# EAGLE schematic jtag-adapter-1-1 (EAGLE 8.4.3)
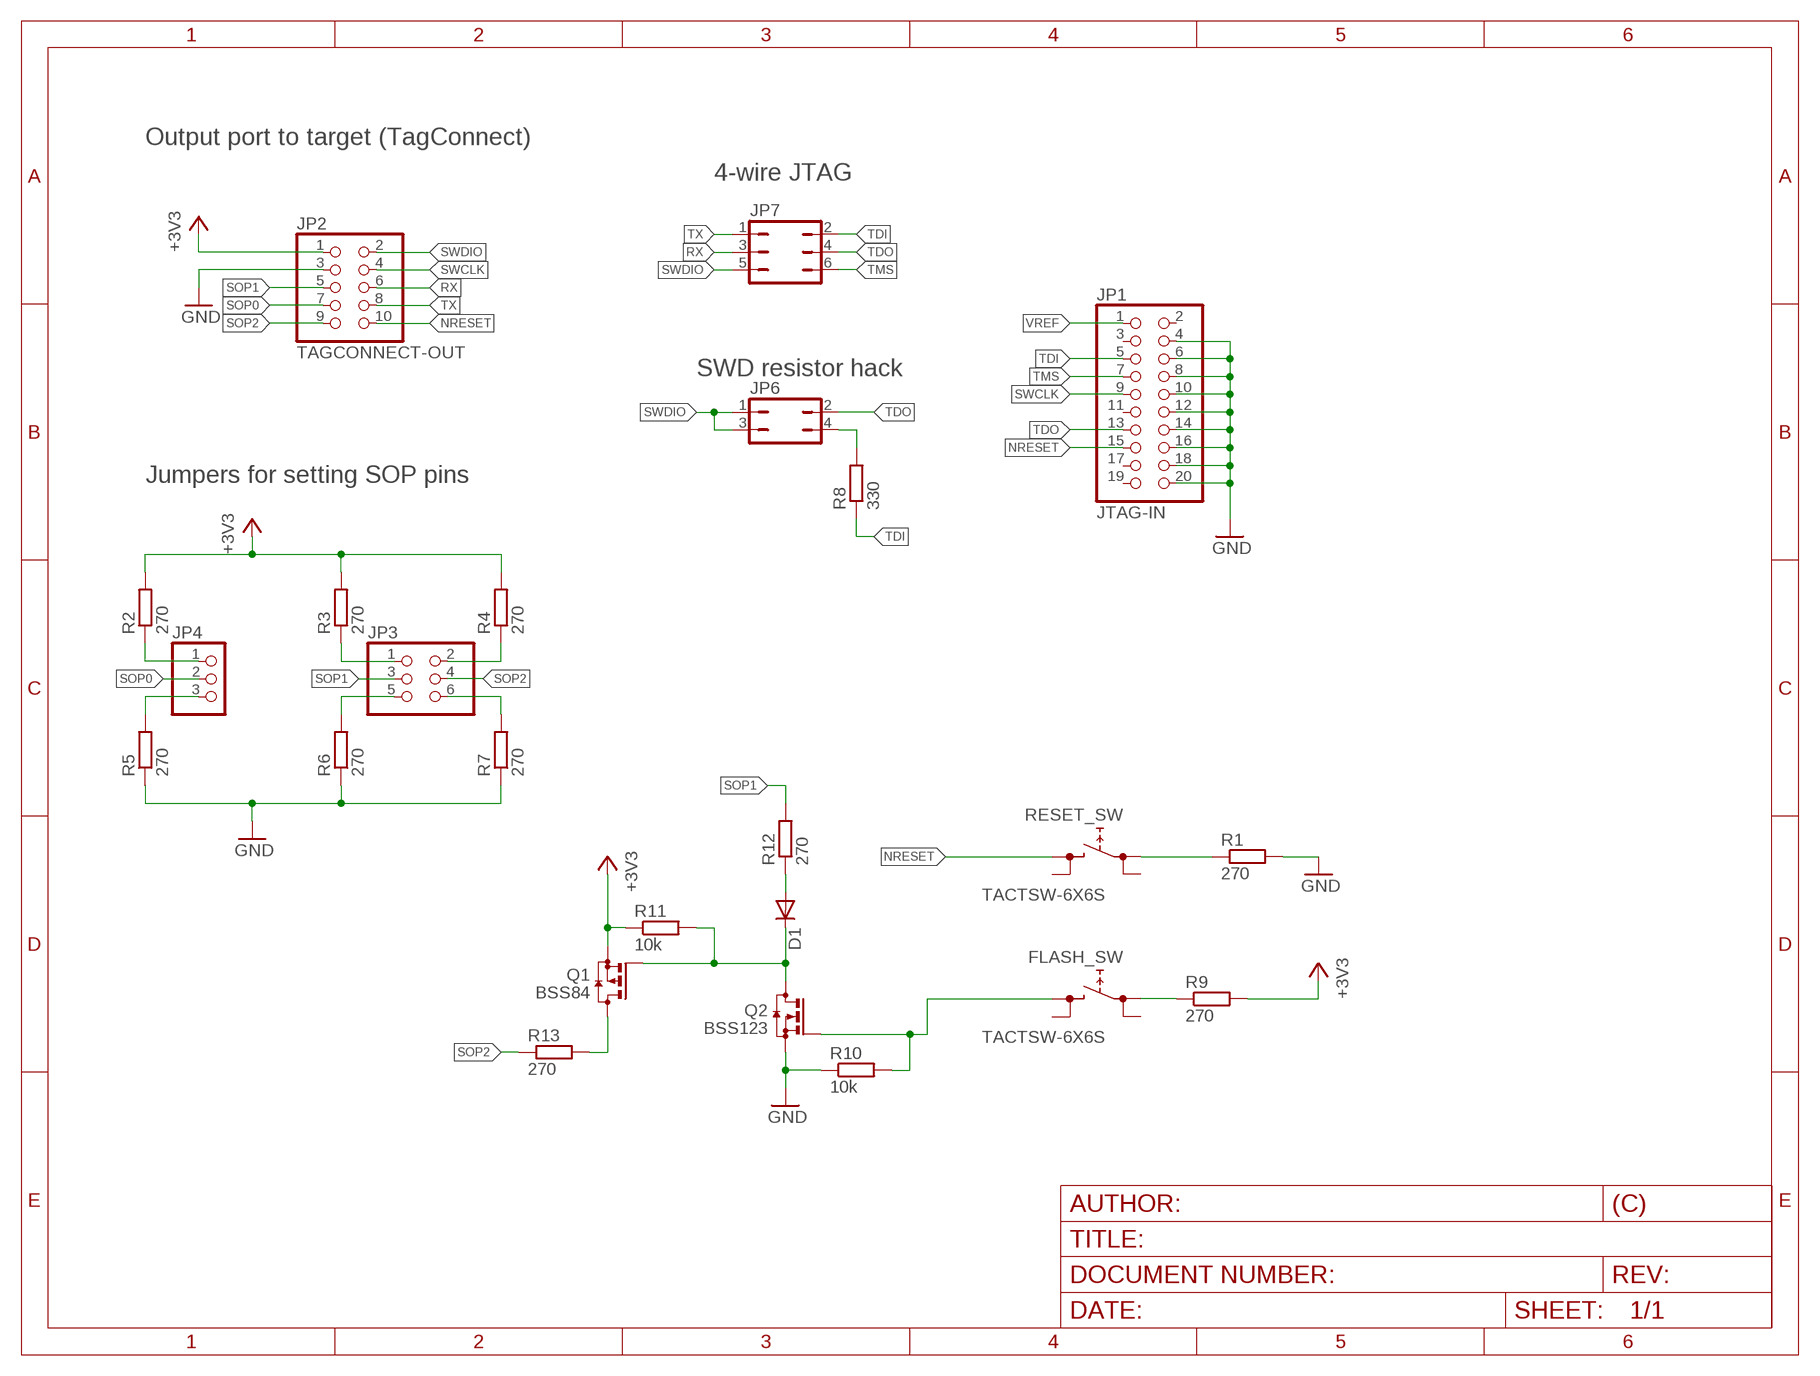
[diagram p0: schematic, sheet 1]

## Parts
D1  DIODE-MINIMELF  [MINIMELF]
FLASH_SW  TACTSW-6X6S  [TACTSW-6X6]
JP1  JTAG-IN  PINHD-2X10/90  [2X10/90]
JP2  TAGCONNECT-OUT  PINHD-2X5CN  [CON10M]
JP3  PINHD-2X3  [2X03]
JP4  PINHD-1X3  [1X03]
JP6  JP2Q  [JP2Q]
JP7  JP3Q  [JP3Q]
Q1  BSS84  [SOT23]
Q2  BSS123  [SOT23]
R1  270  R-EU_R0805  [R0805]
R2  270  R-EU_R0805  [R0805]
R3  270  R-EU_R0805  [R0805]
R4  270  R-EU_R0805  [R0805]
R5  270  R-EU_R0805  [R0805]
R6  270  R-EU_R0805  [R0805]
R7  270  R-EU_R0805  [R0805]
R8  330  R-EU_R0805  [R0805]
R9  270  R-EU_R0805  [R0805]
R10  10k  R-EU_R0805  [R0805]
R11  10k  R-EU_R0805  [R0805]
R12  270  R-EU_R0805  [R0805]
R13  270  R-EU_R0805  [R0805]
RESET_SW  TACTSW-6X6S  [TACTSW-6X6]

## Nets
+3V3: JP2.1 Q1.2(S) R2.2 R3.2 R4.2 R9.2 R11.1
GND: JP1.4 JP1.6 JP1.8 JP1.10 JP1.12 JP1.14 JP1.16 JP1.18 JP1.20 JP2.3 Q2.2(S) R1.2 R5.1 R6.1 R7.1 R10.1
N$1: R1.1 RESET_SW.1(1.1)
N$2: JP4.1 R2.1
N$3: JP4.3 R5.2
N$4: JP6.4 R8.2
N$5: JP3.1 R3.1
N$6: JP3.2 R4.1
N$7: JP3.6 R7.2
N$8: JP3.5 R6.2
N$9: D1.C Q1.1(G) Q2.3(D) R11.2
N$10: FLASH_SW.1(1.1) R9.1
N$11: FLASH_SW.3(2.1) Q2.1(G) R10.2
N$12: D1.A R12.1
N$13: Q1.3(D) R13.2
NRESET: JP1.15 JP2.10 RESET_SW.3(2.1)
RX: JP2.6 JP7.3
SOP0: JP2.7 JP4.2
SOP1: JP2.5 JP3.3 R12.2
SOP2: JP2.9 JP3.4 R13.1
SWCLK: JP1.9 JP2.4
SWDIO: JP2.2 JP6.1 JP6.3 JP7.5
TDI: JP1.5 JP7.2 R8.1
TDO: JP1.13 JP6.2 JP7.4
TMS: JP1.7 JP7.6
TX: JP2.8 JP7.1
VREF: JP1.1
Unconnected: FLASH_SW.2(1.2) FLASH_SW.4(2.2) JP1.2 JP1.3 JP1.11 JP1.17 JP1.19 RESET_SW.2(1.2) RESET_SW.4(2.2)

## Notes on the sheet
- Output port to target (TagConnect)
- 4-wire JTAG
- SWD resistor hack
- Jumpers for setting SOP pins

## Library data of the parts
D1 = diode:DIODE-: DIODE
FLASH_SW RESET_SW = trainlib:TACTSW-6X6: 6.2 X 6.5mm TACT Switch (SMD) Source: http://www3.alps.co.jp/WebObjects/catalog.woa/PDF/E/Switch/Tact/SKHM/SKHM.PDF
JP1 = pinhead:PINHD-2X10: PIN HEADER
JP2 = trainlib:PINHD-2X5: PIN HEADER
JP3 = pinhead:PINHD-2X3: PIN HEADER
JP4 = adafruit:PINHD-1X3: PIN HEADER
JP6 = jumper:JP2Q: JUMPER
JP7 = trainlib:JP3Q: JUMPER
Q1 = trainlib:BSS84: P-CHANNEL MOS FET
Q2 = transistor-small-signal:BSS123: N-CHANNEL MOS FET
R1-R13 = rcl:R-EU_: RESISTOR, European symbol